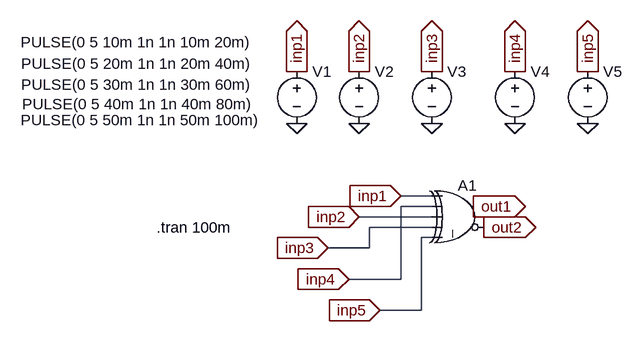
[diagram p0: schematic XOR_and_XNOR.asc]
XOR_and_XNOR.asc, the LTspice schematic file:
Version 4
SHEET 1 880 680
WIRE 144 64 96 64
WIRE 144 80 96 80
WIRE 144 96 32 96
WIRE 144 112 48 112
WIRE 144 128 128 128
WIRE 48 144 48 112
WIRE 48 144 -16 144
WIRE 96 192 96 80
WIRE 96 192 16 192
WIRE 128 240 128 128
WIRE 128 240 64 240
FLAG 96 64 inp1
IOPIN 96 64 In
FLAG 32 96 inp2
IOPIN 32 96 In
FLAG -16 144 inp3
IOPIN -16 144 In
FLAG 16 192 inp4
IOPIN 16 192 In
FLAG 64 240 inp5
IOPIN 64 240 In
FLAG 208 80 out1
IOPIN 208 80 Out
FLAG 224 112 out2
IOPIN 224 112 Out
FLAG -64 -48 0
FLAG 32 -48 0
FLAG 144 -48 0
FLAG 272 -48 0
FLAG 384 -48 0
FLAG -64 -128 inp1
IOPIN -64 -128 Out
FLAG 32 -128 inp2
IOPIN 32 -128 Out
FLAG 144 -128 inp3
IOPIN 144 -128 Out
FLAG 272 -128 inp4
IOPIN 272 -128 Out
FLAG 384 -128 inp5
IOPIN 384 -128 Out
SYMBOL Digital\\xor 192 32 R0
SYMATTR InstName A1
SYMBOL voltage 32 -144 R0
WINDOW 3 -520 4 Left 2
WINDOW 123 0 0 Left 0
WINDOW 39 0 0 Left 0
SYMATTR InstName V2
SYMATTR Value PULSE(0 5 20m 1n 1n 20m 40m)
SYMBOL voltage 144 -144 R0
WINDOW 3 -632 36 Left 2
WINDOW 123 0 0 Left 0
WINDOW 39 0 0 Left 0
SYMATTR InstName V3
SYMATTR Value PULSE(0 5 30m 1n 1n 30m 60m)
SYMBOL voltage 272 -144 R0
WINDOW 3 -759 66 Left 2
WINDOW 123 0 0 Left 0
WINDOW 39 0 0 Left 0
SYMATTR InstName V4
SYMATTR Value PULSE(0 5 40m 1n 1n 40m 80m)
SYMBOL voltage 384 -144 R0
WINDOW 3 -873 91 Left 2
WINDOW 123 0 0 Left 0
WINDOW 39 0 0 Left 0
SYMATTR InstName V5
SYMATTR Value PULSE(0 5 50m 1n 1n 50m 100m)
SYMBOL voltage -64 -144 R0
WINDOW 3 -425 -29 Left 2
WINDOW 123 0 0 Left 0
WINDOW 39 0 0 Left 0
SYMATTR InstName V1
SYMATTR Value PULSE(0 5 10m 1n 1n 10m 20m)
TEXT -280 112 Left 2 !.tran 100m

The netlist it stands for:
* XOR_and_XNOR.asc
A1 inp1 inp4 inp2 inp3 inp5 out2 out1 0 XOR
V2 inp2 0 PULSE(0 5 20m 1n 1n 20m 40m)
V3 inp3 0 PULSE(0 5 30m 1n 1n 30m 60m)
V4 inp4 0 PULSE(0 5 40m 1n 1n 40m 80m)
V5 inp5 0 PULSE(0 5 50m 1n 1n 50m 100m)
V1 inp1 0 PULSE(0 5 10m 1n 1n 10m 20m)
.tran 100m
.backanno
.end

* Results of the author's LTspice run, read from the files saved beside the schematic
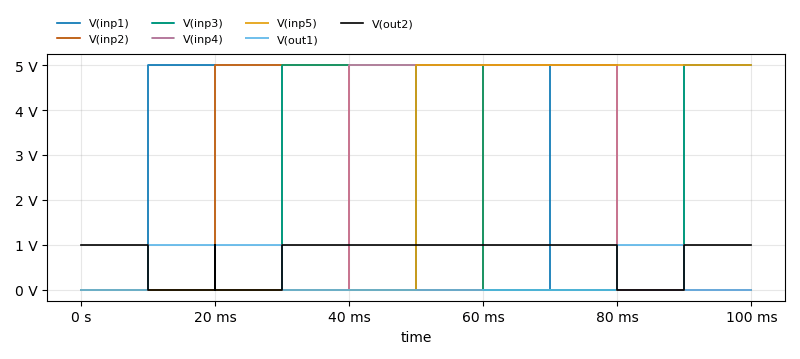
[diagram p1: Transient Analysis of XOR_and_XNOR.asc, plotted from the saved traces]
* Transient Analysis, 1 run:
*   V(inp1): min 0 V, max 5 V, average 2.5 V, rms 3.536 V, last 5 V
*   V(inp2): min 0 V, max 5 V, average 2 V, rms 3.162 V, last 0 V
*   V(inp3): min 0 V, max 5 V, average 2 V, rms 3.162 V, last 5 V
*   V(inp4): min 0 V, max 5 V, average 2 V, rms 3.162 V, last 0 V
*   V(inp5): min 0 V, max 5 V, average 2.5 V, rms 3.536 V, last 5 V
*   V(out1): min 0 V, max 1 V, average 300 mV, rms 547.7 mV, last 0 V
*   V(out2): min 0 V, max 1 V, average 700 mV, rms 836.7 mV, last 1 V